# EAGLE design PAPx2-50 (EAGLE 7.2.0)
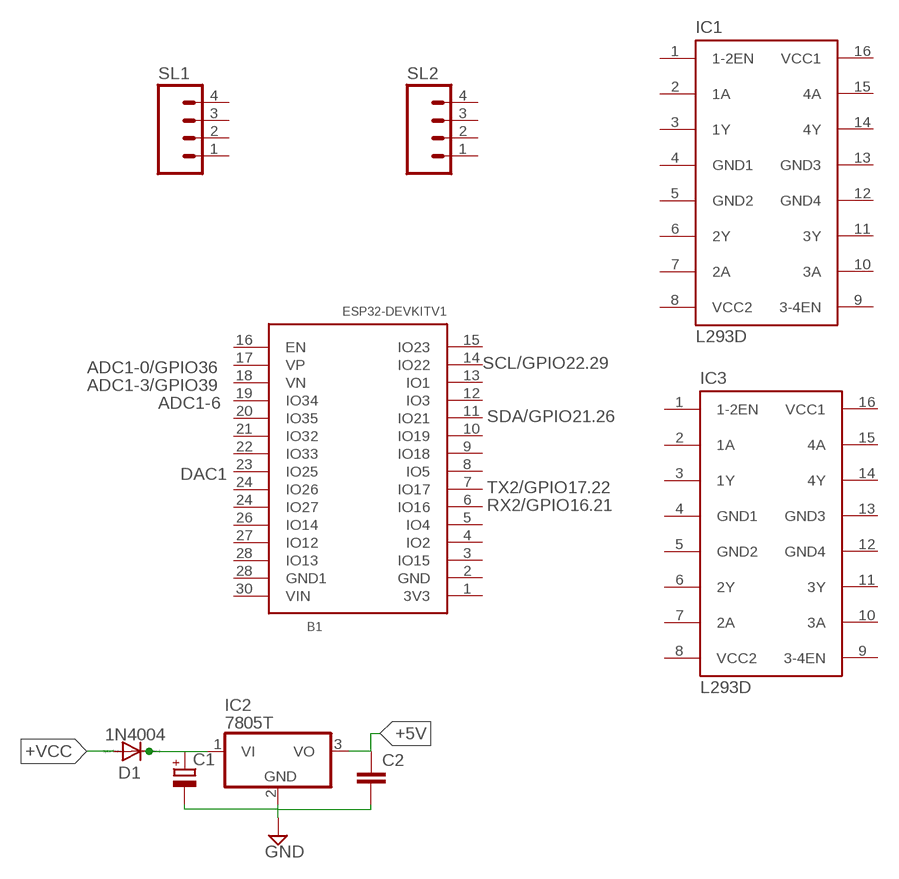
[diagram p0: schematic, sheet 1]

## Parts
B1  ESP32_DEV_KIT_V1  [ESP32-DEVKITV1]
C1  CPOL-EUE2.5-6  [E2,5-6]
C2  C-EU025-025X050  [C025-025X050]
D1  1N4004  [DO41-10]
IC1  L293D  [DIL16]
IC2  7805T  [TO220H]
IC3  L293D  [DIL16]
SL1  M04  [04P]
SL2  M04  [04P]

## Nets
+5V: C2.1 IC2.3(VO)
+VCC: D1.A
GND: C1.- C2.2 IC2.2(GND)
N$4: C1.+ D1.C IC2.1(VI)
Unconnected: B1.1(3V3) B1.2(GND) B1.3(IO15) B1.4(IO2) B1.5(IO4) B1.6(IO16) B1.7(IO17) B1.8(IO5) B1.9(IO18) B1.10(IO19) B1.11(IO21) B1.12(IO3) B1.13(IO1) B1.14(IO22) B1.15(IO23) B1.16(EN) B1.17(VP) B1.18(VN) B1.19(IO34) B1.20(IO35) B1.21(IO32) B1.22(IO33) B1.23(IO25) B1.24(IO26) B1.24(IO27) B1.26(IO14) B1.27(IO12) B1.28(GND1) B1.28(IO13) B1.30(VIN) IC1.1(1-2EN) IC1.2(1A) IC1.3(1Y) IC1.6(2Y) IC1.7(2A) IC1.9(3-4EN) IC1.10(3A) IC1.11(3Y) IC1.14(4Y) IC1.15(4A) IC3.1(1-2EN) IC3.2(1A) IC3.3(1Y) IC3.6(2Y) IC3.7(2A) IC3.9(3-4EN) IC3.10(3A) IC3.11(3Y) IC3.14(4Y) IC3.15(4A) SL1.1 SL1.2 SL1.3 SL1.4 SL2.1 SL2.2 SL2.3 SL2.4

## Notes on the sheet
- ADC1-0/GPIO36 | SCL/GPIO22.29
- ADC1-3/GPIO39
- ADC1-6
- SDA/GPIO21.26
- DAC1
- TX2/GPIO17.22
- RX2/GPIO16.21

## Power pins joined to a net without a drawn wire
GND1: IC1.4(GND1) IC3.4(GND1)
GND2: IC1.5(GND2) IC3.5(GND2)
GND3: IC1.13(GND3) IC3.13(GND3)
GND4: IC1.12(GND4) IC3.12(GND4)
VCC1: IC1.16(VCC1) IC3.16(VCC1)
VCC2: IC1.8(VCC2) IC3.8(VCC2)

## Library data of the parts
B1 = treser_lib:ESP32_DEV_KIT_V1: ESP32 Board
C1 = resistor:CPOL-EU: POLARIZED CAPACITOR, European symbol
C2 = rcl:C-EU: CAPACITOR, European symbol
D1 = diode:1N4004: DIODE general purpose rectifier, 1 A
IC1 IC3 = treser_lib:L293D: Driver L293D Driver PUSH-PULL de 4 canales; MPN: L293D; OC_FARNELL: 9589619; OC_NEWARK: 56P8249
IC2 = linear:78*: Positive VOLTAGE REGULATOR Source: http://cache.national.com/ds/LM/LM78L05.pdf http://www.fairchildsemi.com/ds/LM/LM7805.pdf
SL1 SL2 = con-amp-quick:M04: AMP QUICK CONNECTOR; OC_FARNELL: unknown; OC_NEWARK: unknown

## Board
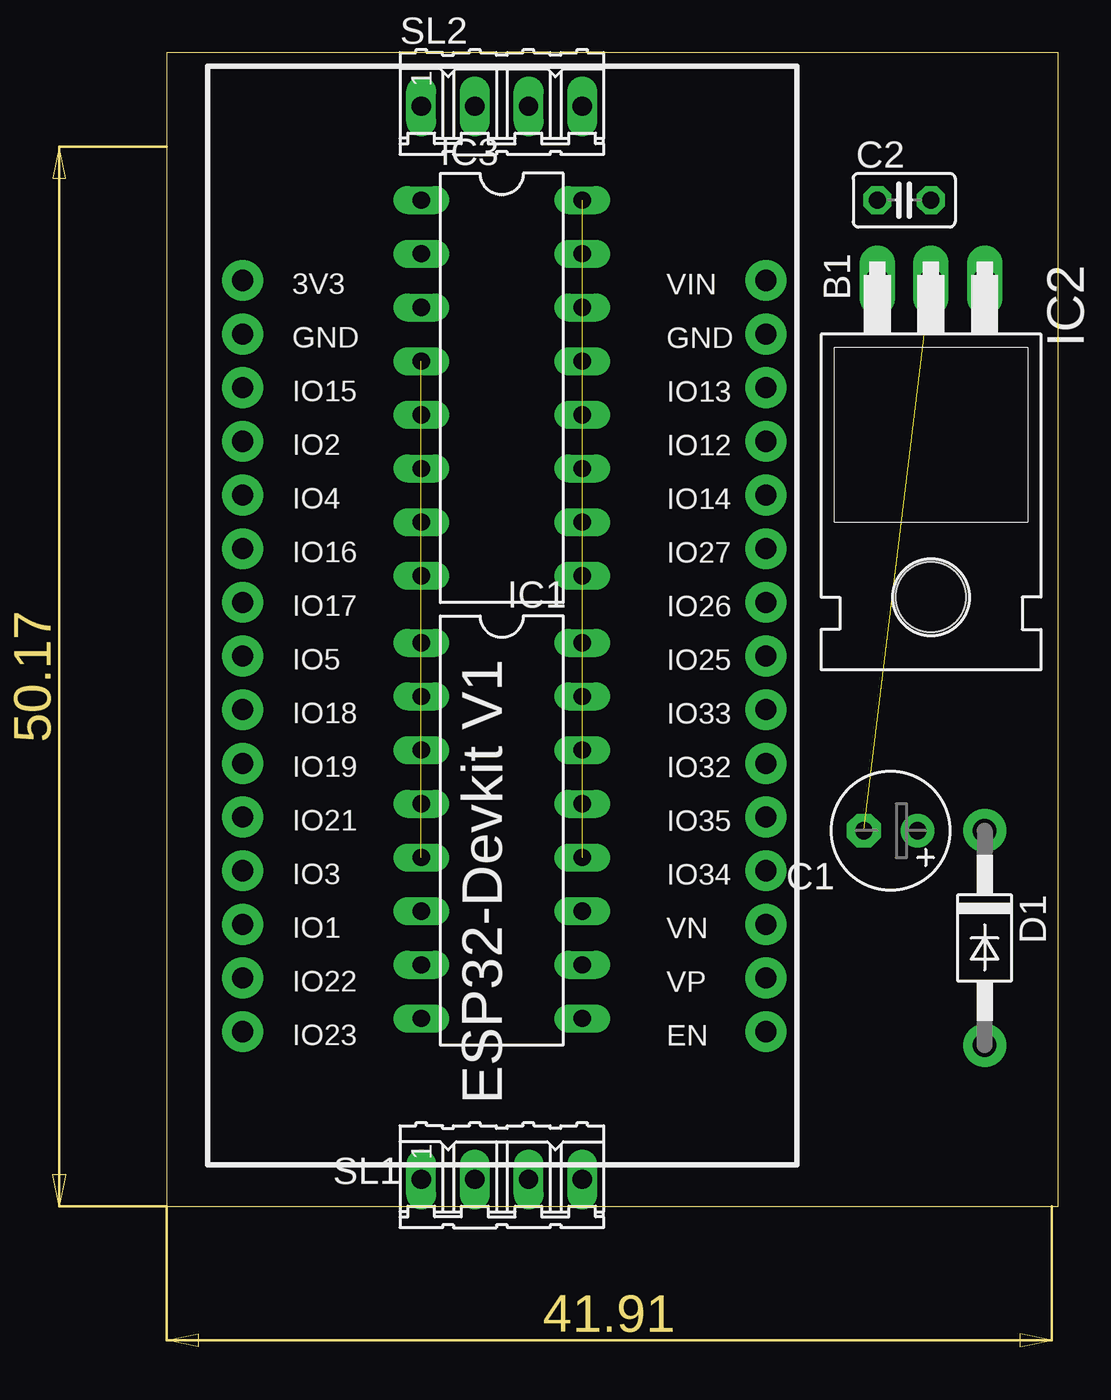
[diagram p1: board, top side]
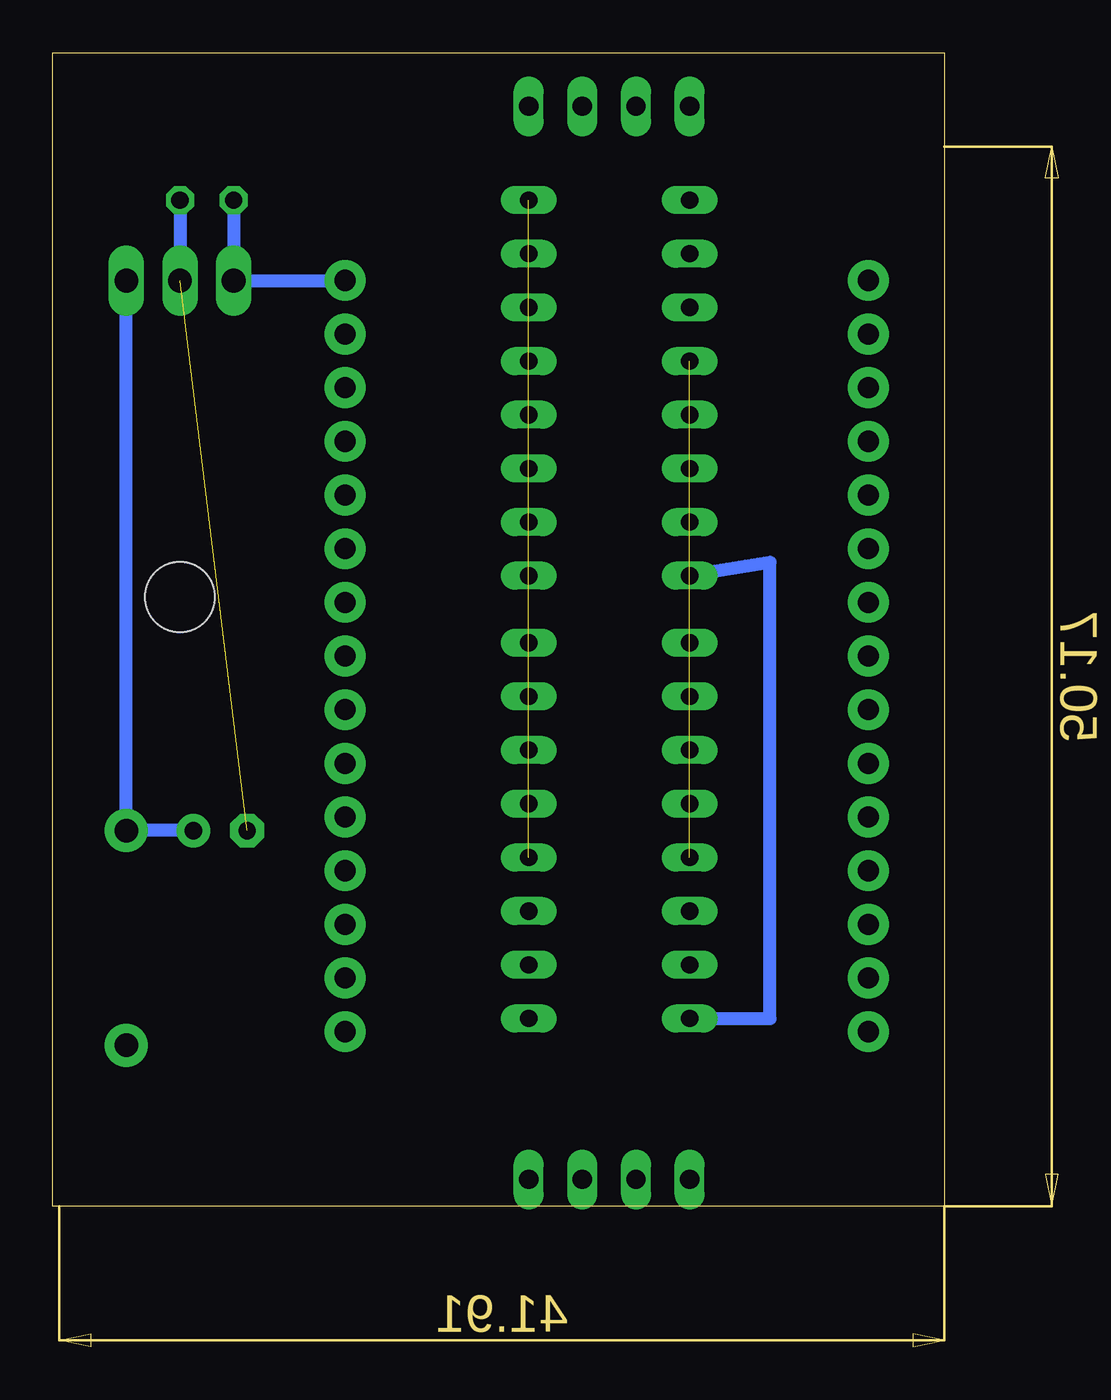
[diagram p2: board, bottom side, seen from below]

Size 42.22 x 54.6 mm. Coordinates in mm from the lower left corner, seen from the top.
Outline: 0,0 42.22,0 42.22,54.6 0,54.6 0,0
Copper layers (1*16): Top 0.035mm / dielectric 1.5mm / Bottom 0.035mm
Design rules "default": minimum track width 10mil, minimum drill 24mil, track to track 8mil, track to pad 8mil, pad to pad 8mil, via to via 8mil, smd to smd 8mil, copper to edge 40mil, drill to drill 8mil, minimum pad ring 10mil, minimum via ring 8mil, stop-mask expansion 4mil, vias tented up to drill 0mil, thermal gap 10mil

### Footprints (pad centres in the part's own frame; a part is rotated, then mirrored left to right if it is on the bottom)
ESP32-DEVKITV1 = drill 1 pad 1.93: 1 -22.87,-13.54; 2 -20.33,-13.54; 3 -17.79,-13.54; 4 -15.25,-13.54; 5 -12.71,-13.54; 6 -10.17,-13.54; 7 -7.63,-13.54; 8 -5.09,-13.54; 9 -2.55,-13.54; 10 -0.01,-13.54; 11 2.53,-13.54; 12 5.07,-13.54; 13 7.61,-13.54; 14 10.15,-13.54; 15 12.69,-13.54; 16 12.69,11.23; 17 10.15,11.23; 18 7.61,11.23; 19 5.07,11.23; 20 2.53,11.23; 21 -0.01,11.23; 22 -2.55,11.23; 23 -5.09,11.23; 24 -7.63,11.23; 25 -10.17,11.23; 26 -12.71,11.23; 27 -15.25,11.23; 28 -17.79,11.23; 29 -20.33,11.23; 30 -22.87,11.23
E2,5-6 = drill 0.813 pad 1.6: + -1.27,0 | drill 0.813 pad 1.6 octagon: - 1.27,0
C025-025X050 = drill 0.813 octagon: 1 -1.27,0; 2 1.27,0
DO41-10 = drill 1.118 pad 2.032: A 5.08,0; C -5.08,0
DIL16 = drill 0.813 long: 1 -8.89,-3.81; 2 -6.35,-3.81; 3 -3.81,-3.81; 4 -1.27,-3.81; 5 1.27,-3.81; 6 3.81,-3.81; 7 6.35,-3.81; 8 8.89,-3.81; 9 8.89,3.81; 10 6.35,3.81; 11 3.81,3.81; 12 1.27,3.81; 13 -1.27,3.81; 14 -3.81,3.81; 15 -6.35,3.81; 16 -8.89,3.81
TO220H = drill 1.118 long: 1 -2.54,-10.16; 2 0,-10.16; 3 2.54,-10.16 | hole 3.302: 0,4.826
04P = drill 0.914 long: 1 -3.81,0; 2 -1.27,0; 3 1.27,0; 4 3.81,0

### Placement (x,y rotation side)
B1  17.14,20.96 270 top
C1  34.29,17.78 180 top
C2  34.92,47.62 0 top
D1  38.73,12.7 270 top
IC1  15.88,17.78 270 top
IC2  36.2,33.66 180 top
IC3  15.88,38.73 270 top
SL1  15.88,1.27 0 top
SL2  15.88,52.07 0 top

### Tracks (layer width: path | path; a pad name or v marks a point on that pad's centre or on a via)
+5V
  Bottom 0.61: 28.58,43.81 IC2.3 C2.1 | 28.58,43.81 28.38,43.81 | 28.56,43.83 28.58,43.81
GND  (1 unrouted)
  Bottom 0.61: C2.2 IC2.2
GND1  (1 unrouted)
GND2  (1 unrouted)
GND3  (1 unrouted)
GND4  (1 unrouted)
N$4
  Bottom 0.61: IC2.1 D1.C C1.+
VCC1  (1 unrouted)
VCC2
  Bottom 0.61: IC1.8 8.25,8.89 8.25,30.48 IC3.8